# Altium schematic sheet UART to USB.SchDoc
size A4; SheetNumber: 3; SheetTotal: 10
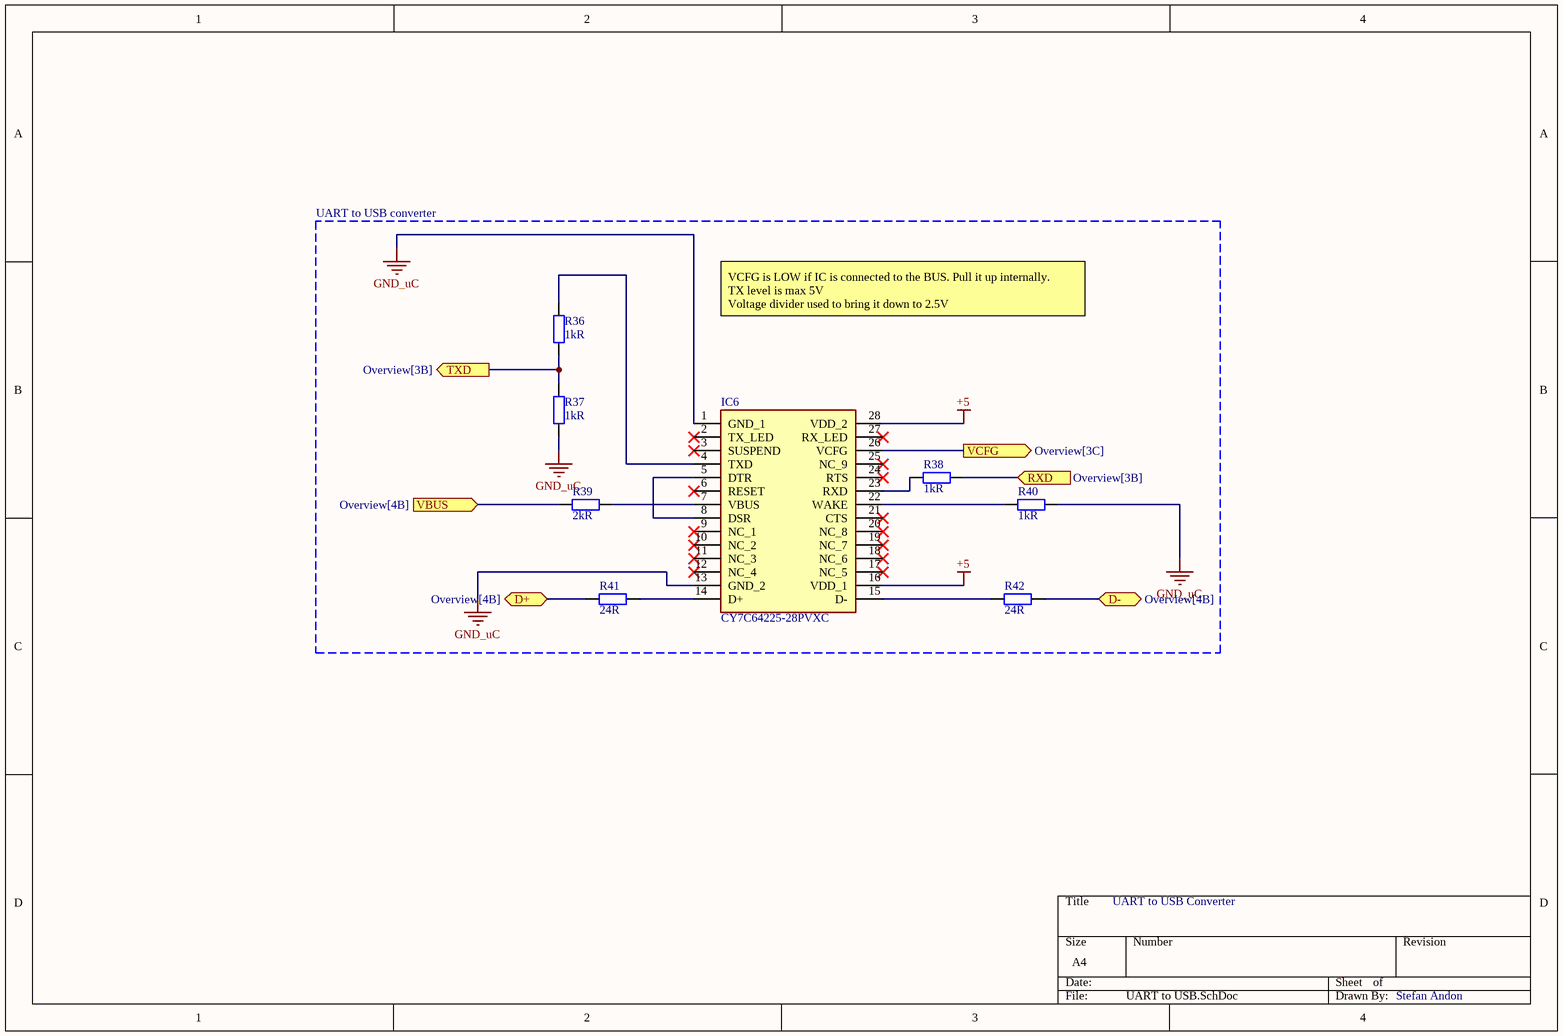
[diagram p0: UART to USB.SchDoc]

## Parts
IC6  CY7C64225-28PVXC  [SOP65P780X200-28N]
R36  value 1kR  [RES_0603]  (hidden comment: Resistor_SMD)
R37  value 1kR  [RES_0603]  (hidden comment: Resistor_SMD)
R38  value 1kR  [RES_0603]  (hidden comment: Resistor_SMD)
R39  value 2kR  [RES_0603]  (hidden comment: Resistor_SMD)
R40  value 1kR  [RES_0603]  (hidden comment: Resistor_SMD)
R41  value 24R  [RES_0603]  (hidden comment: Resistor_SMD)
R42  value 24R  [RES_0603]  (hidden comment: Resistor_SMD)

## Blocks framed on the sheet
UART to USB converter: IC6 R36-R42

## Ports
D+ (bidir, see Overview[4B]), D- (bidir, see Overview[4B]), RXD (in, see Overview[3B]), TXD (out, see Overview[3B]), VBUS (in, see Overview[4B]), VCFG (out, see Overview[3C])

## Nets
+5: IC6.16(VDD_1) IC6.28(VDD_2)
GND_uC: IC6.1(GND_1) IC6.13(GND_2) R37.1 R40.2
D+: R41.1 ; port D+
D-: R42.2 ; port D-
RXD: R38.1 ; port RXD
TXD: R36.1 R37.2 ; port TXD
VBUS: R39.1 ; port VBUS
VCFG: IC6.26(VCFG) ; port VCFG
NetIC6_4: IC6.4(TXD) R36.2
NetIC6_5: IC6.5(DTR) IC6.8(DSR)
NetIC6_7: IC6.7(VBUS) R39.2
NetIC6_14: IC6.14(D+) R41.2
NetIC6_15: IC6.15(D-) R42.1
NetIC6_22: IC6.22(WAKE) R40.1
NetIC6_23: IC6.23(RXD) R38.2

Not connected (* = marked no-connect by the designer): IC6 2(TX_LED)* 3(SUSPEND)* 6(RESET)* 9(NC_1)* 10(NC_2)* 11(NC_3)* 12(NC_4)* 17(NC_5)* 18(NC_6)* 19(NC_7)* 20(NC_8)* 21(CTS)* 24(RTS)* 25(NC_9)* 27(RX_LED)*

## Notes on the sheet
- VCFG is LOW if IC is connected to the BUS. Pull it up internally.
  TX level is max 5V
  Voltage divider used to bring it down to 2.5V
- UART to USB Converter
- Stefan Andon

## Library data of the parts
IC6 = CY7C64225-28PVXC: Integrated Circuit; Manufacturer_Name: Infineon; Datasheet Link: http://www.cypress.com/file/139421/download; Height: 2mm; Manufacturer_Part_Number: CY7C64225-28PVXC; Mouser Part Number: 727-CY7C64225-28PVXC; Mouser Price/Stock: https://www.mouser.co.uk/ProductDetail/Cypress-Semiconductor/CY7C64225-28PVXC?qs=YrQxKq3BqGD638xSzFasMw%3D%3D; Arrow Part Number: CY7C64225-28PVXC; Arrow Price/Stock: https://www.arrow.com/en/products/cy7c64225-28pvxc/cypress-semiconductor?region=nac
R36-R42 = CMP-001-0003-18: Tolerance: tbd; Power: 7W; BOM: Value+', '+Power+', '+Tolerance+', '+CurrentFootprint; Package: tbd